# Altium schematic sheet SensWear_Debug_DEBUG.SchDoc
size A4; DocumentNumber: 2; SheetNumber: 3; SheetTotal: 5
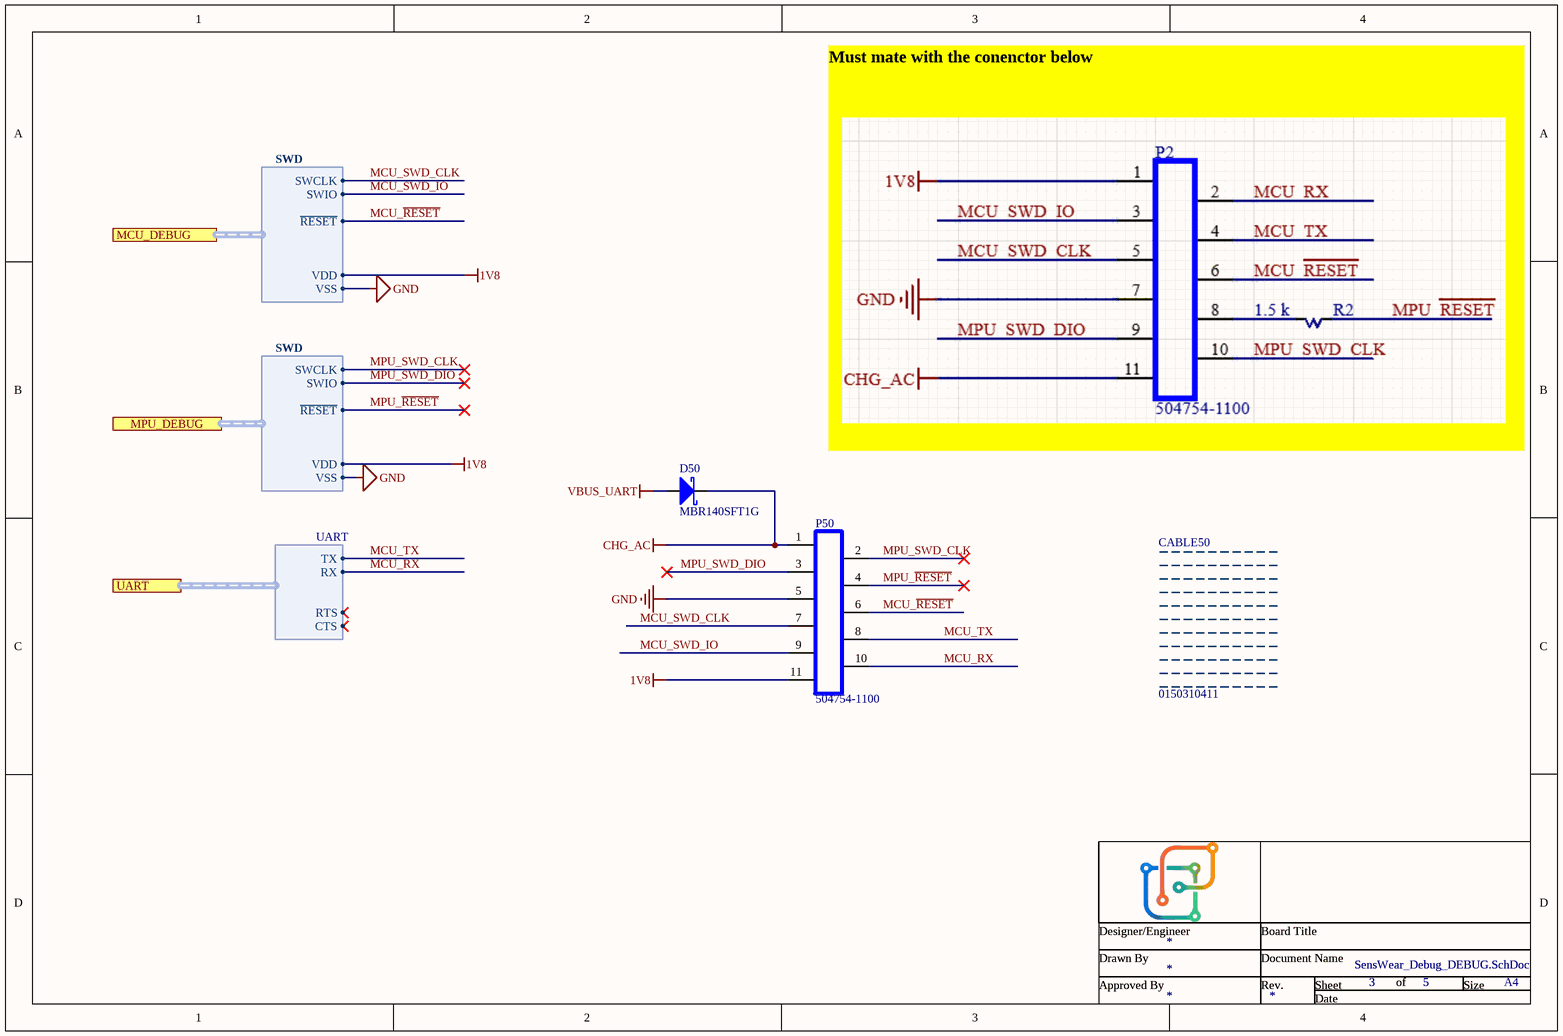
[diagram p0: SensWear_Debug_DEBUG.SchDoc]

## Parts
CABLE50  0150310411
D50  MBR140SFT1G  [SODFL360X110-2N]
P50  504754-1100  [5047541100__3]

## Ports
MCU_DEBUG (harness SWD), MPU_DEBUG (harness SWD), UART (harness UART)

## Harnesses
UART: TX, RX, RTS, CTS
SWD: SWCLK, SWIO, ~{RESET}, VDD, VSS

## Nets
1V8: P50.11 ; port MCU_DEBUG.VDD, port MPU_DEBUG.VDD
CHG_AC: D50.1(cathode) P50.1
GND: P50.5 ; port MCU_DEBUG.VSS, port MPU_DEBUG.VSS
VBUS_UART: D50.2(ANODE)
MCU_~{RESET}: P50.6 ; port MCU_DEBUG.~{RESET}
MCU_RX: P50.10 ; port UART.RX
MCU_SWD_CLK: P50.7 ; port MCU_DEBUG.SWCLK
MCU_SWD_IO: P50.9 ; port MCU_DEBUG.SWIO
MCU_TX: P50.8 ; port UART.TX
MPU_~{RESET}: P50.4 ; port MPU_DEBUG.~{RESET}
MPU_SWD_CLK: P50.2 ; port MPU_DEBUG.SWCLK
MPU_SWD_DIO: P50.3 ; port MPU_DEBUG.SWIO

## Notes on the sheet
- Must mate with the conenctor below
- Designer/Engineer
- Drawn By
- Document Name
- Board Title
- Sheet
- of
- Size
- A4
- Approved By
- Rev.
- Date

## Library data of the parts
CABLE50 = 0150310411: 0.30mm Pitch Premo-Flex FPC Jumper with Notches, Same Side Contacts (Type A), 102.00mm Cable Length, Gold (Au) Plating, 11 Circuits; Manufacturer: Molex; Supplier: Mouser; Supplier Part Number: 538-15031-0411; Manufacturer Part Number: 0150310411; RoHS: No; Stock: 373; Pricing: 1=2.72, 10=2.23, 50=1.99, 100=1.89, 1000=1.69, 10000=1.69 (USD); Supplier 1: Mouser; Supplier Part Number 1: 538-15031-0411; Supplier 2: Farnell; Supplier Part Number 2: 4043858
D50 = MBR140SFT1G: DIODE SCHOTTKY 40V 1A SOD123L; Manufacturer: ON Semiconductor; Voltage - Forward (Vf) (Max) @ If: 550mV @ 1A; Speed: Fast Recovery =< 500ns, > 200mA (Io); Current - Reverse Leakage @ Vr: 500µA @ 40V; Supplier 1: Digi-Key; Manufacturer Part Number: MBR140SFT1G; RoHS: RoHS Compliant; Category: Discrete Semiconductor Products; Stock 1: 29983; Pricing 1: 1=0.3, 10=0.23, 100=0.1431, 500=0.09782, 1000=0.07519 (GBP); Packaging: Digi-Reel®; Part Status: Active; Diode Type: Schottky; Voltage - DC Reverse (Vr) (Max): 40V; Current - Average Rectified (Io): 1A; Reverse Recovery Time (trr): -; Capacitance @ Vr, F: -; Mounting Type: Surface Mount; Package / Case: SOD-123F; Supplier Device Package: SOD-123L; Operating Temperature - Junction: -55°C ~ 125°C; ComponentLink1URL: http://www.onsemi.com/pub_link/Collateral/MBR140SFT1-D.PDF; ComponentLink1Description: http://www.onsemi.com/pub_link/Collateral/MBR140SFT1-D.PDF; Supplier Part Number 1: MBR140SFT1GOSDKR-ND
P50 = 504754-1100: Conn FFC/FPC Connector SKT 11 POS 0.3mm Solder RA SMD Easy-On™ T/R; Manufacturer: Molex; CHECKED: FALSE; Supplier: Mouser; Supplier Part Number: 538-504754-1100; Manufacturer Part Number: 504754-1100; RoHS: No; Stock: 6459; Pricing: 1=0.77, 10=0.628, 50=0.544, 100=0.512, 1000=0.426, 10000=0.355 (USD); ComponentLink1URL: https://datasheet.octopart.com/504754-1100-Molex-datasheet-169278456.pdf?src-supplier=Farnell; ComponentLink1Description: https://datasheet.octopart.com/504754-1100-Molex-datasheet-169278456.pdf?src-supplier=Farnell; ComponentLink2URL: http://datasheet.octopart.com/5047541100-Molex-datasheet-38188796.pdf?src-supplier=Onlinecomponents.com; ComponentLink2Description: http://datasheet.octopart.com/5047541100-Molex-datasheet-38188796.pdf?src-supplier=Onlinecomponents.com; ComponentLink3URL: http://datasheet.octopart.com/5047541100-Molex-datasheet-38188796.pdf?src-supplier=Verical; ComponentLink3Description: http://datasheet.octopart.com/5047541100-Molex-datasheet-38188796.pdf?src-supplier=Verical; ComponentLink4URL: http://datasheet.octopart.com/5047541100-Molex-datasheet-38188796.pdf?src-supplier=Avnet; ComponentLink4Description: http://datasheet.octopart.com/5047541100-Molex-datasheet-38188796.pdf?src-supplier=Avnet; ComponentLink5URL: http://datasheet.octopart.com/5047541100-Molex-datasheet-38188796.pdf?src-supplier=TTI; ComponentLink5Description: http://datasheet.octopart.com/5047541100-Molex-datasheet-38188796.pdf?src-supplier=TTI; ComponentLink6URL: http://datasheet.octopart.com/5047541100-Molex-datasheet-38188796.pdf?src-supplier=Electro+Sonic; ComponentLink6Description: http://datasheet.octopart.com/5047541100-Molex-datasheet-38188796.pdf?src-supplier=Electro+Sonic; ComponentLink7URL: https://datasheet.octopart.com/504754-1100-Molex-datasheet-154754160.pdf?src-supplier=Master+Electronics; ComponentLink7Description: https://datasheet.octopart.com/504754-1100-Molex-datasheet-154754160.pdf?src-supplier=Master+Electronics; Supplier 1: Mouser; Supplier Part Number 1: 538-504754-1100; System: Connector